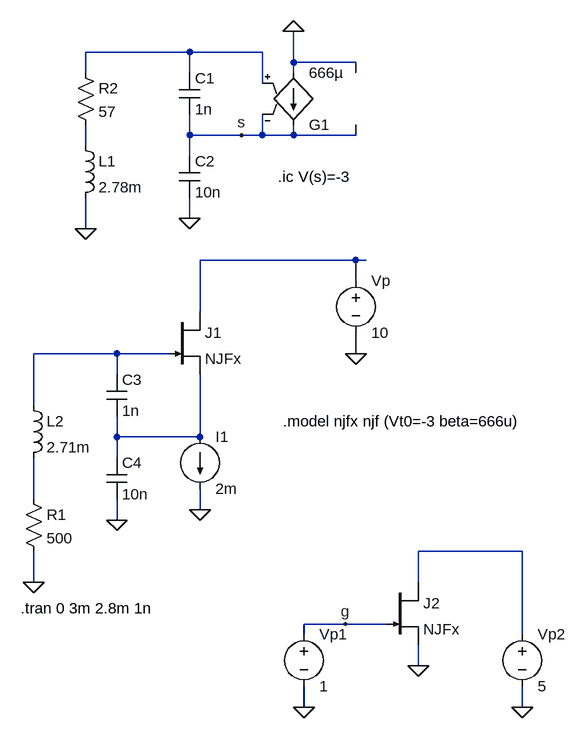
[diagram p0: schematic jfet.asc]
jfet.asc, the LTspice schematic file:
Version 4
SHEET 1 880 772
WIRE -32 -256 -192 -256
WIRE 80 -256 -32 -256
WIRE 128 -240 128 -288
WIRE 224 -240 128 -240
WIRE -192 -224 -192 -256
WIRE -32 -224 -32 -256
WIRE 128 -224 128 -240
WIRE 224 -224 224 -240
WIRE 80 -208 80 -256
WIRE -32 -128 -32 -160
WIRE 48 -128 -32 -128
WIRE 80 -128 80 -160
WIRE 80 -128 48 -128
WIRE 128 -128 128 -144
WIRE 128 -128 80 -128
WIRE 224 -128 224 -144
WIRE 224 -128 128 -128
WIRE -192 -112 -192 -144
WIRE -32 -96 -32 -128
WIRE -32 0 -32 -32
WIRE -192 16 -192 -32
WIRE 224 64 -16 64
WIRE 240 64 224 64
WIRE 224 96 224 64
WIRE -16 144 -16 64
WIRE -144 208 -272 208
WIRE -64 208 -144 208
WIRE 224 208 224 176
WIRE -144 240 -144 208
WIRE -272 288 -272 208
WIRE -144 336 -144 304
WIRE -16 336 -16 240
WIRE -16 336 -144 336
WIRE -144 368 -144 336
WIRE -272 432 -272 368
WIRE -16 448 -16 416
WIRE -144 464 -144 432
WIRE 480 512 320 512
WIRE -272 560 -272 512
WIRE 320 560 320 512
WIRE 208 624 144 624
WIRE 272 624 208 624
WIRE 144 640 144 624
WIRE 480 640 480 512
WIRE 320 688 320 656
WIRE 144 752 144 720
WIRE 480 752 480 720
FLAG 224 208 0
FLAG -272 560 0
FLAG 144 752 0
FLAG 480 752 0
FLAG 320 688 0
FLAG 208 624 g
FLAG -192 16 0
FLAG -32 0 0
FLAG 128 -288 0
FLAG 48 -128 s
FLAG -144 464 0
FLAG -16 448 0
SYMBOL voltage 224 80 R0
WINDOW 123 0 0 Left 2
WINDOW 39 0 0 Left 2
SYMATTR InstName Vp
SYMATTR Value 10
SYMBOL njf -64 144 R0
SYMATTR InstName J1
SYMATTR Value NJFx
SYMBOL res -288 416 R0
SYMATTR InstName R1
SYMATTR Value 500
SYMBOL njf 272 560 R0
SYMATTR InstName J2
SYMATTR Value NJFx
SYMBOL voltage 144 624 R0
WINDOW 123 0 0 Left 2
WINDOW 39 0 0 Left 2
SYMATTR InstName Vp1
SYMATTR Value 1
SYMBOL voltage 480 624 R0
WINDOW 123 0 0 Left 2
WINDOW 39 0 0 Left 2
SYMATTR InstName Vp2
SYMATTR Value 5
SYMBOL res -208 -240 R0
SYMATTR InstName R2
SYMATTR Value 57
SYMBOL cap -48 -224 R0
SYMATTR InstName C1
SYMATTR Value 1n
SYMBOL cap -48 -96 R0
SYMATTR InstName C2
SYMATTR Value 10n
SYMBOL g2 128 -128 M180
SYMATTR InstName G1
SYMATTR Value 666µ
SYMBOL ind -208 -128 R0
SYMATTR InstName L1
SYMATTR Value 2.78m
SYMBOL ind -288 272 R0
SYMATTR InstName L2
SYMATTR Value 2.71m
SYMBOL cap -160 240 R0
SYMATTR InstName C3
SYMATTR Value 1n
SYMBOL cap -160 368 R0
SYMATTR InstName C4
SYMATTR Value 10n
SYMBOL current -16 336 R0
WINDOW 123 0 0 Left 2
WINDOW 39 0 0 Left 2
SYMATTR InstName I1
SYMATTR Value 2m
TEXT 112 312 Left 2 !.model njfx njf (Vt0=-3 beta=666u)
TEXT -292 600 Left 2 !.tran 0 3m 2.8m 1n
TEXT 104 -64 Left 2 !.ic V(s)=-3

The netlist it stands for:
* jfet.asc
Vp N003 0 10
J1 N003 N004 N005 NJFx
R1 N006 0 500
J2 N007 g 0 NJFx
Vp1 g 0 1
Vp2 N007 0 5
R2 N001 N002 57
C1 N001 s 1n
C2 s 0 10n
G1 0 s N001 s 666µ
L1 N002 0 2.78m
L2 N004 N006 2.71m
C3 N004 N005 1n
C4 N005 0 10n
I1 N005 0 2m
.model NJF NJF
.model PJF PJF
.lib standard.jft
.model njfx njf (Vt0=-3 beta=666u)
.tran 0 3m 2.8m 1n
.ic V(s)=-3
.backanno
.end